# Altium schematic sheet Sheet4.SchDoc
size A4; SheetNumber: 4; SheetTotal: 4
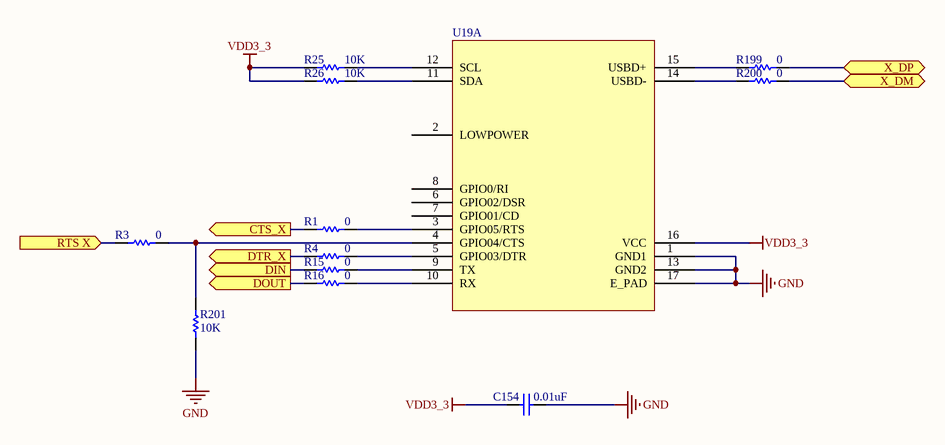
[diagram p0: Sheet4.SchDoc]

## Parts
C154  value 0.01uF  [CAPC1005X35N]  (hidden comment: Cap)
R1  value 0  [RESC1005X35N]  (hidden comment: Res1)
R3  value 0  [RESC1005X35N]  (hidden comment: Res1)
R4  value 0  [RESC1005X35N]  (hidden comment: Res1)
R15  value 0  [RESC1005X35N]  (hidden comment: Res1)
R16  value 0  [RESC1005X35N]  (hidden comment: Res1)
R25  value 10K  [RESC1005X35N]  (hidden comment: Res1)
R26  value 10K  [RESC1005X35N]  (hidden comment: Res1)
R199  value 0  [RESC1005X35N]  (hidden comment: Res1)
R200  value 0  [RESC1005X35N]  (hidden comment: Res1)
R201  value 10K  [RESC1005X35N]  (hidden comment: Res1)
U19  (no value)  [QFN50P300X300X90-17N]  (part A of 2)

## Ports
CTS_X (out), DIN (out), DOUT (out), DTR_X (out), RTS X (in), X_DM (bidir), X_DP (bidir)

## Nets
GND: C154.2 R201.1 U19.1(GND1) U19.13(GND2) U19.17(E_PAD)
VDD3_3: C154.1 R25.1 R26.1 U19.16(VCC)
CTS_X: R1.1 ; port CTS_X
DIN: R15.1 ; port DIN
DOUT: R16.1 ; port DOUT
DTR_X: R4.1 ; port DTR_X
RTS X: R3.1 ; port RTS X
X_DM: R200.2 ; port X_DM
X_DP: R199.2 ; port X_DP
NetR1_2: R1.2 U19.3(GPIO05/RTS)
NetR3_2: R3.2 R201.2 U19.4(GPIO04/CTS)
NetR4_2: R4.2 U19.5(GPIO03/DTR)
NetR15_2: R15.2 U19.9(TX)
NetR16_2: R16.2 U19.10(RX)
NetR25_2: R25.2 U19.12(SCL)
NetR26_2: R26.2 U19.11(SDA)
NetR199_1: R199.1 U19.15(USBD+)
NetR200_1: R200.1 U19.14(USBD-)

Not connected (* = marked no-connect by the designer): U19 2(LOWPOWER) 6(GPIO02/DSR) 7(GPIO01/CD) 8(GPIO0/RI)

## Library data of the parts
C154 = Cap: Capacitor; Published: 8-Jun-2000; LatestRevisionDate: 17-Jul-2002; LatestRevisionNote: Re-released for DXP Platform.; PackageReference: RAD-0.3; Publisher: Altium Limited; PackageDescription: Radial Cap, Thru-Hole; 2 Leads; 0.3 in Pin Spacing
R1 R3 R4 R15 R16 R25 R26 R199-R201 = Res1: Resistor; Published: 8-Jun-2000; LatestRevisionDate: 17-Jul-2002; LatestRevisionNote: Re-released for DXP Platform.; PackageReference: AXIAL-0.3; Publisher: Altium Limited; PackageDescription: Axial Device, Thru-Hole; 2 Leads; 0.3 in Pin Spacing
U19 = XR21V1410